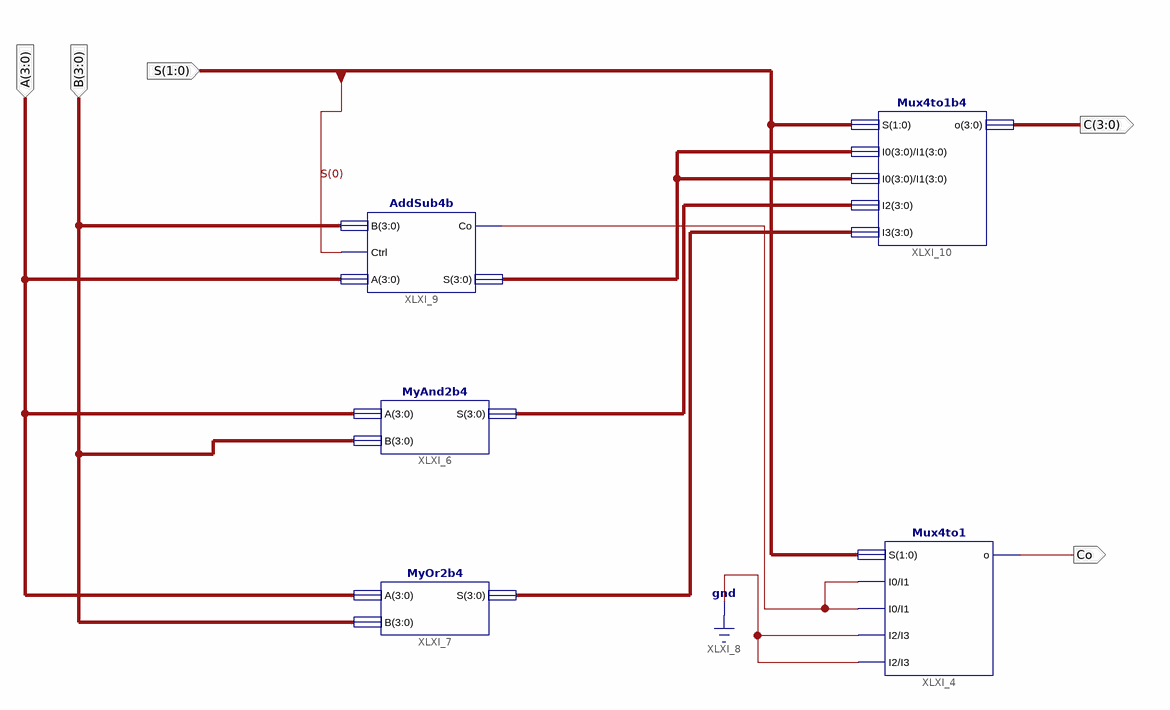
[diagram p0: schematic sheet 1]
// Xilinx ISE schematic ALU.sch (kintex7) as structural Verilog: 5 symbols, 5 ports
module ALU (
  input  [3:0] A,
  input  [3:0] B,
  input  [1:0] S,
  output [3:0] C,
  output Co
);

  wire XLXN_15;
  wire [3:0] XLXN_10, XLXN_11, XLXN_12;

  Mux4to1 XLXI_4 (.S(S), .I0(XLXN_15), .I1(XLXN_15), .I2(1'b0), .I3(1'b0), .o(Co));
  MyAnd2b4 XLXI_6 (.A(A), .B(B), .S(XLXN_11));
  MyOr2b4 XLXI_7 (.A(A), .B(B), .S(XLXN_12));
  AddSub4b XLXI_9 (.B(B), .Ctrl(S[0]), .A(A), .Co(XLXN_15), .S(XLXN_10));
  Mux4to1b4 XLXI_10 (.S(S), .I0(XLXN_10), .I1(XLXN_10), .I2(XLXN_11), .I3(XLXN_12), .o(C));
endmodule
